# Altium schematic sheet 10-DashLEDs.SchDoc
size A4
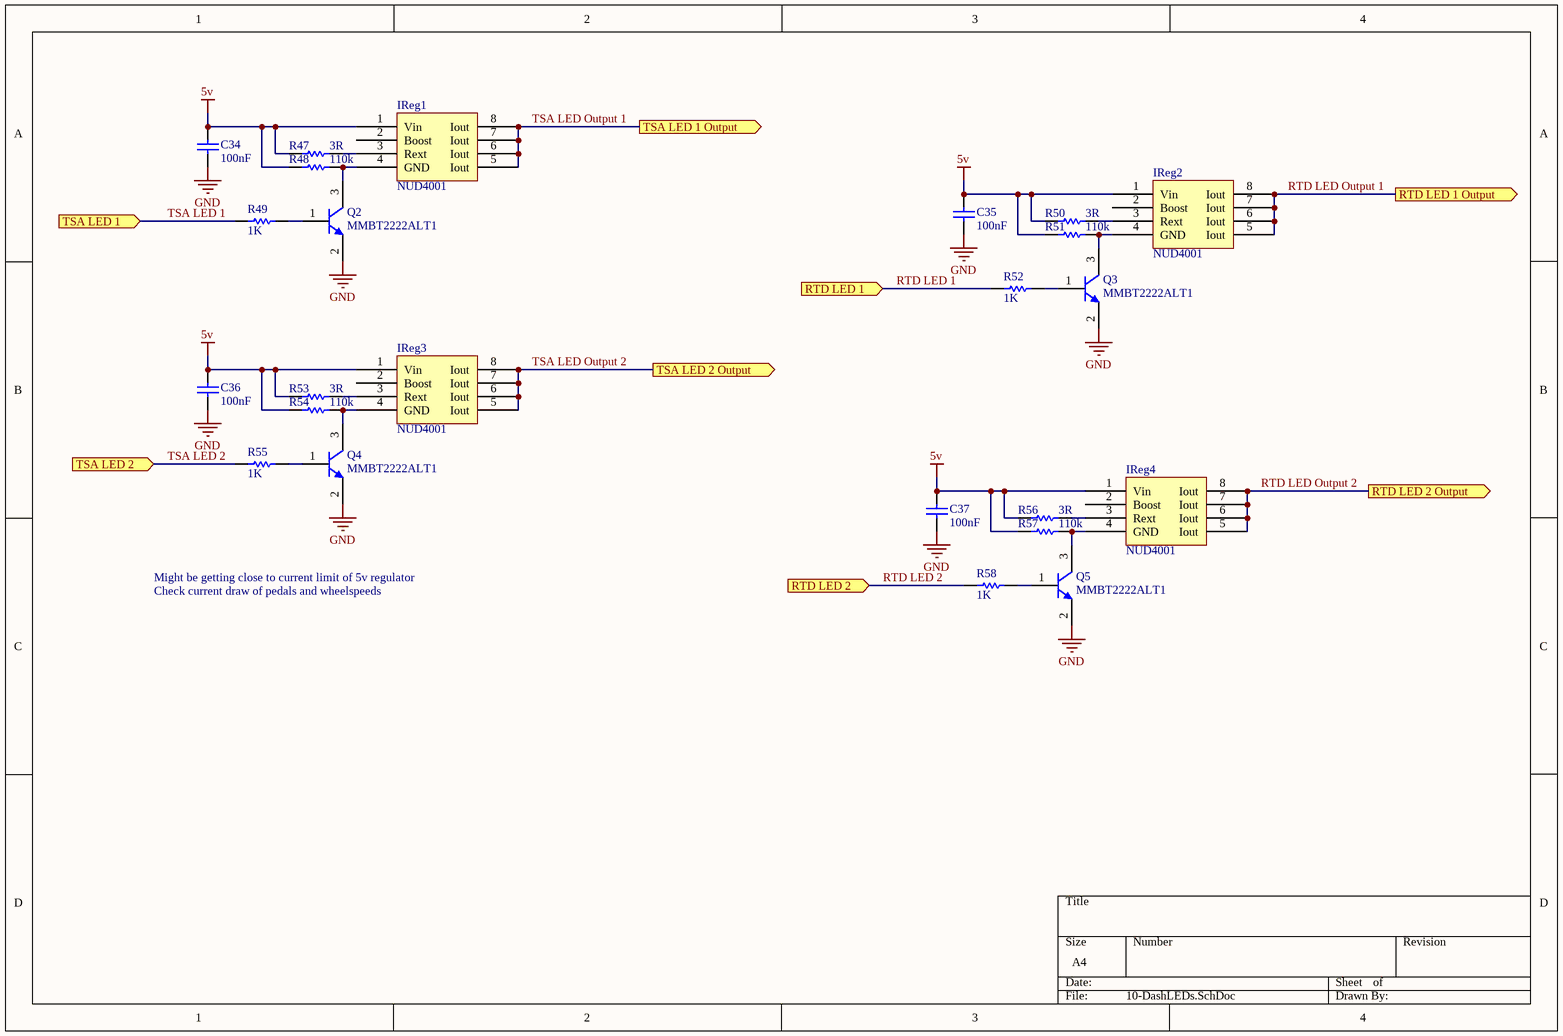
[diagram p0: 10-DashLEDs.SchDoc]

## Parts
C34  value 100nF  [1608[0603]]  (hidden comment: Cap)
C35  value 100nF  [1608[0603]]  (hidden comment: Cap)
C36  value 100nF  [1608[0603]]  (hidden comment: Cap)
C37  value 100nF  [1608[0603]]  (hidden comment: Cap)
IReg1  NUD4001  [SO8_M]
IReg2  NUD4001  [SO8_M]
IReg3  NUD4001  [SO8_M]
IReg4  NUD4001  [SO8_M]
Q2  MMBT2222ALT1  [ONSC-SOT-23-3-318-08_V]
Q3  MMBT2222ALT1  [ONSC-SOT-23-3-318-08_V]
Q4  MMBT2222ALT1  [ONSC-SOT-23-3-318-08_V]
Q5  MMBT2222ALT1  [ONSC-SOT-23-3-318-08_V]
R47  value 3R  [1608[0603]]  (hidden comment: Res1)
R48  value 110k  [1608[0603]]  (hidden comment: Res1)
R49  value 1K  [1608[0603]]  (hidden comment: Res1)
R50  value 3R  [1608[0603]]  (hidden comment: Res1)
R51  value 110k  [1608[0603]]  (hidden comment: Res1)
R52  value 1K  [1608[0603]]  (hidden comment: Res1)
R53  value 3R  [1608[0603]]  (hidden comment: Res1)
R54  value 110k  [1608[0603]]  (hidden comment: Res1)
R55  value 1K  [1608[0603]]  (hidden comment: Res1)
R56  value 3R  [1608[0603]]  (hidden comment: Res1)
R57  value 110k  [1608[0603]]  (hidden comment: Res1)
R58  value 1K  [1608[0603]]  (hidden comment: Res1)

## Ports
RTD LED 1 (in), RTD LED 1 Output (out), RTD LED 2 (in), RTD LED 2 Output (out), TSA LED 1 (in), TSA LED 1 Output (out), TSA LED 2 (in), TSA LED 2 Output (out)

## Nets
5v: C34.2 C35.2 C36.2 C37.2 IReg1.1(Vin) IReg2.1(Vin) IReg3.1(Vin) IReg4.1(Vin) R47.1 R48.1 R50.1 R51.1 R53.1 R54.1 R56.1 R57.1
GND: C34.1 C35.1 C36.1 C37.1 Q2.2(E) Q3.2(E) Q4.2(E) Q5.2(E)
RTD LED 1: R52.2 ; port RTD LED 1
RTD LED 2: R58.2 ; port RTD LED 2
RTD LED Output 1: IReg2.5(Iout) IReg2.6(Iout) IReg2.7(Iout) IReg2.8(Iout) ; port RTD LED 1 Output
RTD LED Output 2: IReg4.5(Iout) IReg4.6(Iout) IReg4.7(Iout) IReg4.8(Iout) ; port RTD LED 2 Output
TSA LED 1: R49.2 ; port TSA LED 1
TSA LED 2: R55.2 ; port TSA LED 2
TSA LED Output 1: IReg1.5(Iout) IReg1.6(Iout) IReg1.7(Iout) IReg1.8(Iout) ; port TSA LED 1 Output
TSA LED Output 2: IReg3.5(Iout) IReg3.6(Iout) IReg3.7(Iout) IReg3.8(Iout) ; port TSA LED 2 Output
NetIReg1_3: IReg1.3(Rext) R47.2
NetIReg1_4: IReg1.4(GND) Q2.3(C) R48.2
NetIReg2_3: IReg2.3(Rext) R50.2
NetIReg2_4: IReg2.4(GND) Q3.3(C) R51.2
NetIReg3_3: IReg3.3(Rext) R53.2
NetIReg3_4: IReg3.4(GND) Q4.3(C) R54.2
NetIReg4_3: IReg4.3(Rext) R56.2
NetIReg4_4: IReg4.4(GND) Q5.3(C) R57.2
NetQ2_1: Q2.1(B) R49.1
NetQ3_1: Q3.1(B) R52.1
NetQ4_1: Q4.1(B) R55.1
NetQ5_1: Q5.1(B) R58.1

Not connected (* = marked no-connect by the designer): IReg1 2(Boost); IReg2 2(Boost); IReg3 2(Boost); IReg4 2(Boost)

## Notes on the sheet
- Might be getting close to current limit of 5v regulator
- Check current draw of pedals and wheelspeeds

## Library data of the parts
C34-C37 = Cap: Capacitor; Manufacturer: Yageo; Manufacturer Part Number: CC0603KRX7R9BB104; Capacitance: 0.10µF; Tolerance: ±10%; Voltage - Rated: 50V; Temperature Coefficient: X7R; Supplier 1: Digi-Key; Supplier Part Number 1: 311-1344-1-ND; RoHS: RoHS Compliant; Category: Capacitors; Stock 1: 4016262; Pricing 1: 1=0.15, 10=0.043, 25=0.0312, 50=0.0232, 100=0.0189, 250=0.0158, 500=0.01346, 1000=0.01059 (CAD); Packaging: Cut Tape (CT); Part Status: Active; Operating Temperature: -55°C ~ 125°C; Features: -; Ratings: -; Applications: General Purpose; Failure Rate: -; Mounting Type: Surface Mount, MLCC; Package / Case: 0603 (1608 Metric); Size / Dimension: 0.063" L x 0.031" W (1.60mm x 0.80mm); Height - Seated (Max): -; Thickness (Max): 0.035" (0.90mm); Lead Spacing: -; Lead Style: -; ComponentLink1URL: http://www.yageo.com/documents/recent/UPY-GPHC_X7R_6.3V-to-50V_16.pdf; ComponentLink1Description: http://www.yageo.com/documents/recent/UPY-GPHC_X7R_6.3V-to-50V_16.pdf
IReg1-IReg4 = LED Currnet Driver, 500mA, 30V max: Manufacturer: ON Semiconductor; Manufacturer Part Number: NUD4001DR2G; Internal Switch(s): Yes; Number of Outputs: 1; Voltage - Supply (Min): 3.6V; Voltage - Supply (Max): 30V; Voltage - Output: 28V; Current - Output / Channel: 500mA; Dimming: PWM; Supplier 1: Digi-Key; Supplier Part Number 1: NUD4001DR2GOSCT-ND; RoHS: RoHS Compliant; Category: Integrated Circuits (ICs); Stock 1: 212669; Pricing 1: 1=1.36, 10=1.197, 100=0.9174, 500=0.72524, 1000=0.58019 (CAD); Packaging: Cut Tape (CT); Part Status: Active; Type: Linear; Topology: -; Frequency: -; Applications: Automotive, Lighting; Operating Temperature: -40°C ~ 125°C (TA); Mounting Type: Surface Mount; Package / Case: 8-SOIC (0.154", 3.90mm Width); Supplier Device Package: 8-SOIC; ComponentLink1URL: http://www.onsemi.com/pub_link/Collateral/NUD4001-D.PDF; ComponentLink1Description: http://www.onsemi.com/pub_link/Collateral/NUD4001-D.PDF
Q2-Q5 = CMP-1048-00593-1: General Purpose Transistor, NPN Silicon, 3-Pin SOT-23, Tape and Reel; Manufacturer: On Semiconductor; fT Min (MHz): 300; IC Continuous (A): 0.6; ComponentLink1Description: Manufacturer URL; PackageDescription: 3-Pin Small Outline Transistor, Body 2.92 x 1.3 mm, Pitch 0.95 mm; PackageReference: SOT-23-3-318-08; Polarity: NPN; Packing: Tape and Reel; RoHS: FALSE; Mounting Technology: Surface Mount; PackageVersion: Rev. AP, 11/2009; DatasheetVersion: Rev. 10; PartNumber: MMBT2222ALT1; ComponentLink3Description: Package Specification; ComponentLink2Description: Datasheet; ComponentLink3URL: http://www.onsemi.cn/pub_link/Collateral/318-08.PDF; ComponentLink1URL: http://www.onsemi.com/; ComponentLink2URL: http://www.onsemi.cn/pub_link/Collateral/MMBT2222LT1-D.PDF
R47 R50 R53 R56 = Res1: Resistor; Manufacturer: Yageo; Manufacturer Part Number: RC0603FR-072RL; Resistance (Ohms): 2; Tolerance: ±1%; Power (Watts): 0.1W, 1/10W; Temperature Coefficient: ±200ppm/°C; Supplier 1: Digi-Key; Supplier Part Number 1: 311-2.00HRCT-ND; RoHS: RoHS Compliant; Category: Resistors; Stock 1: 84378; Pricing 1: 1=0.16, 10=0.03, 25=0.022, 50=0.0166, 100=0.0122, 250=0.00936, 500=0.00746, 1000=0.0055 (CAD); Packaging: Cut Tape (CT); Part Status: Active; Composition: Thick Film; Features: Moisture Resistant; Operating Temperature: -55°C ~ 155°C; Package / Case: 0603 (1608 Metric); Supplier Device Package: 0603; Size / Dimension: 0.063" L x 0.031" W (1.60mm x 0.80mm); Height - Seated (Max): 0.022" (0.55mm); Number of Terminations: 2; Failure Rate: -; ComponentLink1URL: http://www.yageo.com/NewPortal/yageodocoutput?fileName=/pdf/R-Chip/PYu-RC_Group_51_RoHS_L_4.pdf; ComponentLink1Description: http://www.yageo.com/NewPortal/yageodocoutput?fileName=/pdf/R-Chip/PYu-RC_Group_51_RoHS_L_4.pdf
R48 R51 R54 R57 = Res1: Resistor; Manufacturer: Yageo; Manufacturer Part Number: RC0603JR-07110KL; Tolerance: ±5%; Power (Watts): 0.1W, 1/10W; Temperature Coefficient: ±100ppm/°C; Supplier 1: Digi-Key; Supplier Part Number 1: 311-110KGRCT-ND; RoHS: RoHS Compliant; Category: Resistors; Stock 1: 85509; Pricing 1: 1=0.16, 10=0.016, 25=0.0112, 50=0.0084, 100=0.0062, 250=0.0048, 500=0.00382, 1000=0.00281 (CAD); Packaging: Cut Tape (CT); Part Status: Active; Resistance (Ohms): 110k; Composition: Thick Film; Features: Moisture Resistant; Operating Temperature: -55°C ~ 155°C; Package / Case: 0603 (1608 Metric); Supplier Device Package: 0603; Size / Dimension: 0.063" L x 0.031" W (1.60mm x 0.80mm); Height - Seated (Max): 0.022" (0.55mm); Number of Terminations: 2; Failure Rate: -; ComponentLink1URL: http://www.yageo.com/NewPortal/yageodocoutput?fileName=/pdf/R-Chip/PYu-RC_Group_51_RoHS_L_4.pdf; ComponentLink1Description: http://www.yageo.com/NewPortal/yageodocoutput?fileName=/pdf/R-Chip/PYu-RC_Group_51_RoHS_L_4.pdf
R49 R52 R55 R58 = Res1: Resistor; Manufacturer: Panasonic Electronic Components; Manufacturer Part Number: ERJ-PA3F1001V; Tolerance: ±1%; Power (Watts): 0.25W, 1/4W; Temperature Coefficient: ±100ppm/°C; Supplier 1: Digi-Key; Supplier Part Number 1: P1.0KBYCT-ND; RoHS: RoHS Compliant; Category: Resistors; Stock 1: 56110; Pricing 1: 1=0.22, 10=0.198, 25=0.138, 50=0.1072, 100=0.0765, 250=0.05972, 500=0.04746, 1000=0.03368 (CAD); Packaging: Cut Tape (CT); Part Status: Active; Resistance (Ohms): 1k; Composition: Thick Film; Features: Automotive AEC-Q200, Pulse Withstanding; Operating Temperature: -55°C ~ 155°C; Package / Case: 0603 (1608 Metric); Supplier Device Package: 0603; Size / Dimension: 0.063" L x 0.031" W (1.60mm x 0.80mm); Height - Seated (Max): 0.022" (0.55mm); Number of Terminations: 2; Failure Rate: -; ComponentLink1URL: https://industrial.panasonic.com/cdbs/www-data/pdf/RDA0000/AOA0000C243.pdf; ComponentLink1Description: https://industrial.panasonic.com/cdbs/www-data/pdf/RDA0000/AOA0000C243.pdf